# Altium schematic sheet Microcontroller.SchDoc: HI
size A4 portrait; Cel: Ehh; Projektant: Teodor
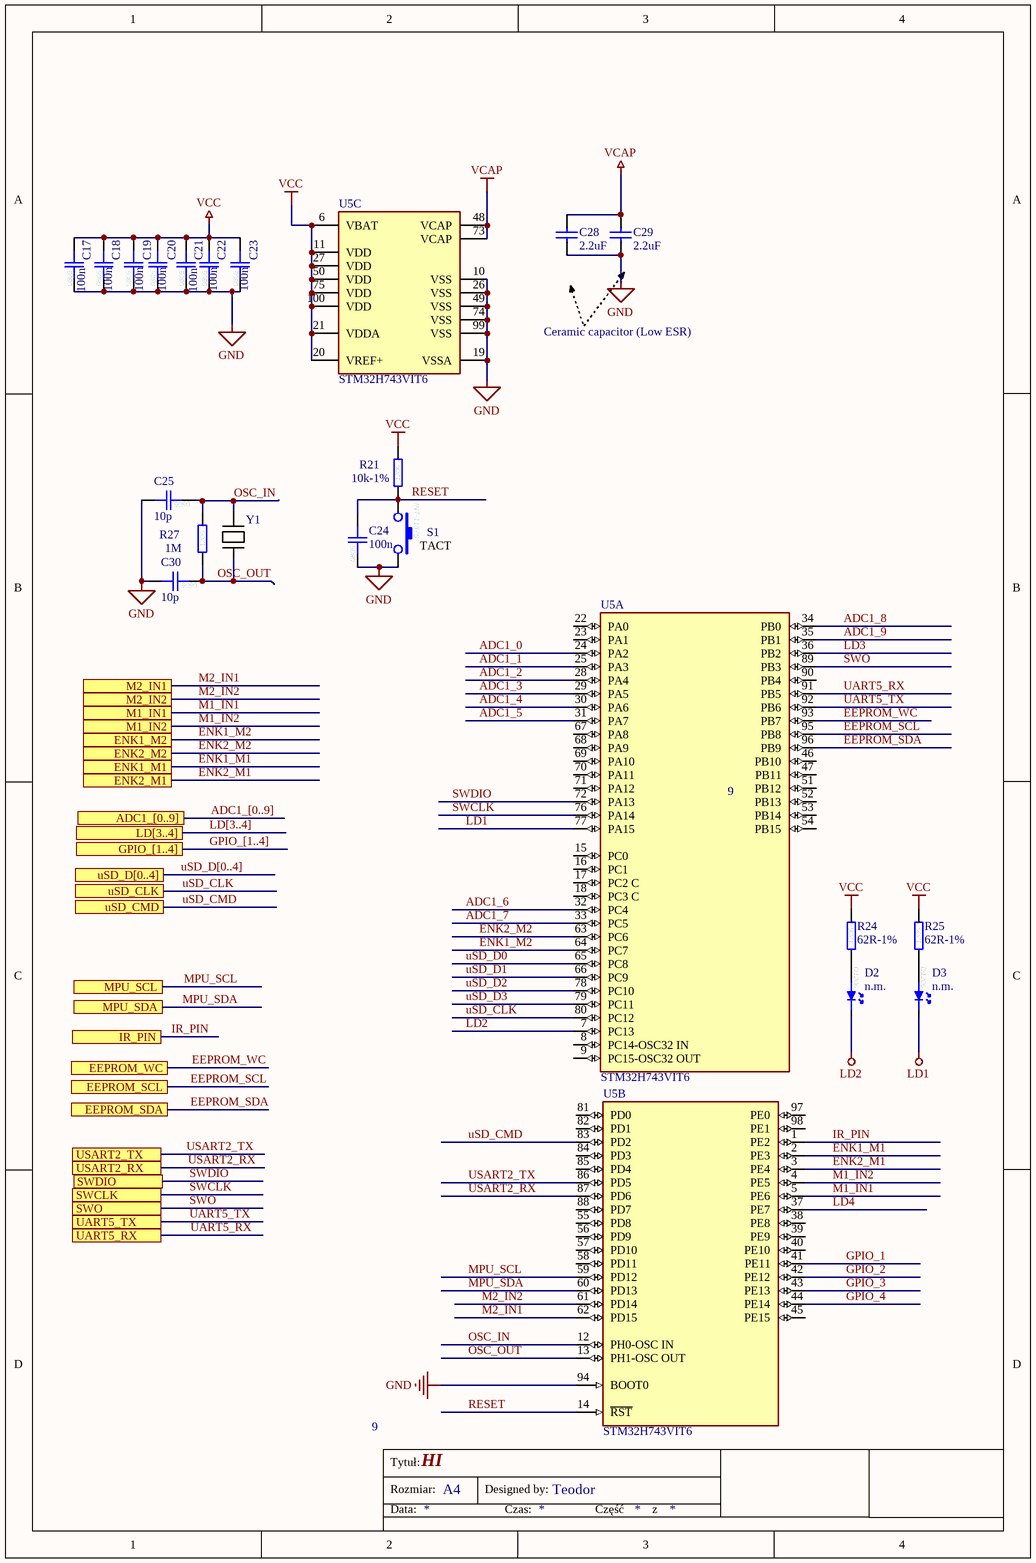
[diagram p0: Microcontroller.SchDoc]

## Parts
C17  100n  [0805C]
C18  100n  [0805C]
C19  100n  [0805C]
C20  100n  [0805C]
C21  100n  [0805C]
C22  100n  [0805C]
C23  100n  [0805C]
C24  100n  [0805C]
C25  10p  [0805C]
C28  2.2uF  [1206C]
C29  2.2uF  [1206C]
C30  10p  [0805C]
D2  n.m.  [D1206]  (no BOM)
D3  n.m.  [D1206]  (no BOM)
R21  10k-1%  [1206R]
R24  62R-1%  [1206R]
R25  62R-1%  [1206R]
R27  1M  [1206R]
S1  TACT  [INT-1187S_16]
U5  STM32H743VIT6  [FP-LQFP100-1L-MFG]  (parts A,B,C of 3)
Y1  Rezonator_z_Botland  [Rezonator_z_Botlandu]  (value not drawn)

## Ports
ADC1_[0..9], EEPROM_SCL, EEPROM_SDA, EEPROM_WC, ENK1_M1, ENK1_M2, ENK2_M1, ENK2_M2, GPIO_[1..4], IR_PIN, LD[3..4], M1_IN1, M1_IN2, M2_IN1, M2_IN2, MPU_SCL, MPU_SDA, SWCLK, SWDIO, SWO, UART5_RX, UART5_TX, USART2_RX, USART2_TX, uSD_CLK, uSD_CMD, uSD_D[0..4]

## Nets
GND: C17.2 C18.2 C19.2 C20.2 C21.2 C22.2 C23.2 C24.2 C25.1 C28.1 C29.1 C30.1 S1.2 U5.10(VSS) U5.19(VSSA) U5.26(VSS) U5.49(VSS) U5.74(VSS) U5.94(BOOT0) U5.99(VSS)
LD1: D3.1(K) U5.77(PA15)
LD2: D2.1(K) U5.7(PC13)
VCAP: C28.2 C29.2 U5.48(VCAP) U5.73(VCAP)
VCC: C17.1 C18.1 C19.1 C20.1 C21.1 C22.1 C23.1 R21.1 R24.1 R25.1 U5.6(VBAT) U5.11(VDD) U5.20(VREF+) U5.21(VDDA) U5.27(VDD) U5.50(VDD) U5.75(VDD) U5.100(VDD)
ADC1_0: U5.24(PA2)
ADC1_1: U5.25(PA3)
ADC1_2: U5.28(PA4)
ADC1_3: U5.29(PA5)
ADC1_4: U5.30(PA6)
ADC1_5: U5.31(PA7)
ADC1_6: U5.32(PC4)
ADC1_7: U5.33(PC5)
ADC1_8: U5.34(PB0)
ADC1_9: U5.35(PB1)
EEPROM_SCL: U5.95(PB8) ; port EEPROM_SCL
EEPROM_SDA: U5.96(PB9) ; port EEPROM_SDA
EEPROM_WC: U5.93(PB7) ; port EEPROM_WC
ENK1_M1: U5.2(PE3) ; port ENK1_M1
ENK1_M2: U5.64(PC7) ; port ENK1_M2
ENK2_M1: U5.3(PE4) ; port ENK2_M1
ENK2_M2: U5.63(PC6) ; port ENK2_M2
GPIO_1: U5.41(PE11)
GPIO_2: U5.42(PE12)
GPIO_3: U5.43(PE13)
GPIO_4: U5.44(PE14)
IR_PIN: U5.1(PE2) ; port IR_PIN
LD3: U5.36(PB2)
LD4: U5.37(PE7)
M1_IN1: U5.5(PE6) ; port M1_IN1
M1_IN2: U5.4(PE5) ; port M1_IN2
M2_IN1: U5.62(PD15) ; port M2_IN1
M2_IN2: U5.61(PD14) ; port M2_IN2
MPU_SCL: U5.59(PD12) ; port MPU_SCL
MPU_SDA: U5.60(PD13) ; port MPU_SDA
OSC_IN: C25.2 R27.2 U5.12(PH0-OSC_IN) Y1.1
OSC_OUT: C30.2 R27.1 U5.13(PH1-OSC_OUT) Y1.2
RESET: C24.1 R21.2 S1.1 U5.14(~{RST})
SWCLK: U5.76(PA14) ; port SWCLK
SWDIO: U5.72(PA13) ; port SWDIO
SWO: U5.89(PB3) ; port SWO
UART5_RX: U5.91(PB5) ; port UART5_RX
UART5_TX: U5.92(PB6) ; port UART5_TX
USART2_RX: U5.87(PD6) ; port USART2_RX
USART2_TX: U5.86(PD5) ; port USART2_TX
uSD_CLK: U5.80(PC12) ; port uSD_CLK
uSD_CMD: U5.83(PD2) ; port uSD_CMD
uSD_D0: U5.65(PC8)
uSD_D1: U5.66(PC9)
uSD_D2: U5.78(PC10)
uSD_D3: U5.79(PC11)
NetD2_2: D2.2(A) R24.2
NetD3_2: D3.2(A) R25.2

Not connected (* = marked no-connect by the designer): U5 8(PC14-OSC32_IN) 9(PC15-OSC32_OUT) 15(PC0) 16(PC1) 17(PC2_C) 18(PC3_C) 22(PA0) 23(PA1) 38(PE8) 39(PE9) 40(PE10) 45(PE15) 46(PB10) 47(PB11) 51(PB12) 52(PB13) 53(PB14) 54(PB15) 55(PD8) 56(PD9) 57(PD10) 58(PD11) 67(PA8) 68(PA9) 69(PA10) 70(PA11) 71(PA12) 81(PD0) 82(PD1) 84(PD3) 85(PD4) 88(PD7) 90(PB4) 97(PE0) 98(PE1)

## Buses and harness runs
bus ADC1_[0..9] = port ADC1_[0..9]
bus GPIO_[1..4] = port GPIO_[1..4]
bus LD[3..4] = port LD[3..4]
bus uSD_D[0..4] = port uSD_D[0..4]

## Notes on the sheet
- Ceramic capacitor (Low ESR)
- (near U5) 9
- 9
- Tytuł:
- Rozmiar:
- Data:
- A4
- Designed by:
- Czas:
- Część
- z
- (in symbol 10k-1%  1206) 1206
- (in symbol 10n  0805) 0805
- (in symbol 10p  0805) 0805
- (in symbol 62R-1%  1206) 1206
- (in symbol 100k-1%  1206) 1206
- (in symbol 100n  0805) 0805
- (in symbol n.m.  D1206) D1206
- (in symbol TACTDF52H16M250  INT-1187S_16) INT-1187S

## Library data of the parts
C17-C23 = 10n  0805: Kond. ceramiczny X7R  50V  10%; Nazwa: 10n
C24 = 100n  0805: Kond. ceramiczny X7R  50V  10%; Indeks: 5566; Nazwa: 100n
C25 C30 = 10p  0805: Kond. ceramiczny NP0  50V; Nazwa: 10p
C28 C29 = Cap_2.2uF_X7R_10%_1206: Capacitor,2.2uF,16V, X7R,10%,1206,YAGEO; Manuf_Part_1: CC1206KKX7R7BB225; Manuf_Part_2: C1206C225K4RAC; Manuf_2: KEMET; Revision: July-2002: Re-released for DXP Platform.; Value: 2.2uF; Order: CC1206KKX7R7BB225; Manuf_1: YAGEO; ECCN_US/EU: n/a
D2 D3 = n.m.  D1206: Dioda LED; Index: -; Nazwa: n.m.
R21 = 10k-1%  1206: Rezystor 0,25W; Nazwa: 10k-1%
R24 R25 = 62R-1%  1206: Rezystor 0,25W; Nazwa: 62R-1%
R27 = 100k-1%  1206: Rezystor 0,25W; Nazwa: 100k-1%
S1 = TACTDF52H16M250  INT-1187S_16: Switch SMD h=1,6mm Innocent  INT-1187S_16; Index: 11540; Nazwa: TACTDF52H16M250
U5 = CMP-12105-000050-1: IC MCU 32BIT 2MB FLASH 100LQFP; Manufacturer: STMicroelectronics; Number Of Ethernet Channels: 1; Number Of Usb Channels: 2; Number Of A/D Converters: 3; Min Supply Voltage: 1.71V; Ram Size: 1060KBytes; Number Of I2C Channels: 4; Frequency: 480MHz; Number Of Adc Channels: 36; Number Of I/Os: 82; Max Supply Voltage: 3.6V; Number Of Spi Channels: 6; Memory Size: 2MBytes; Max Junction Temp: +125°C; Core Architecture: Arm Cortex-M7; Interface: I2C,SPI,UART,USART,USB,LIN,IrDA,Ethernet,I2S,Other; Number Of Timers/Counters: 20; Data Bus Width: 32bits; Number Of Pwm Channels: 42; Number Of Uart Channels: 9; Standoff Height: 0.05mm; Device Class L1: Integrated Circuits (ICs); ComponentLink2URL: https://www.st.com/resource/en/datasheet/stm32h743vi.pdf; Automotive: No; Memory Type: FLASH; Number Of Cores: 1; Temperature Range Low: -40°C; RoHS: TRUE; Ambient Temperature Range Low: -40°C; ComponentLink2Description: Datasheet; Device Class L2: Embedded Processors and Controllers; Device Class L3: Microcontrollers; Digikey Description: IC MCU 32BIT 2MB FLASH 100LQFP; Temperature Range High: +125°C; Ambient Temperature Range High: +85°C; Package: LQFP100-1L; Temperature: -40°C to +125°C; Category: IC; Ipc Land Pattern Name: QFP50P1600X1600X160-100; Height: 1.6mm; Manufacturer Part Number: STM32H743VIT6; Octopart: https://octopart.com/stm32h743vit6-stmicroelectronics-76372527; Lead Free: Yes